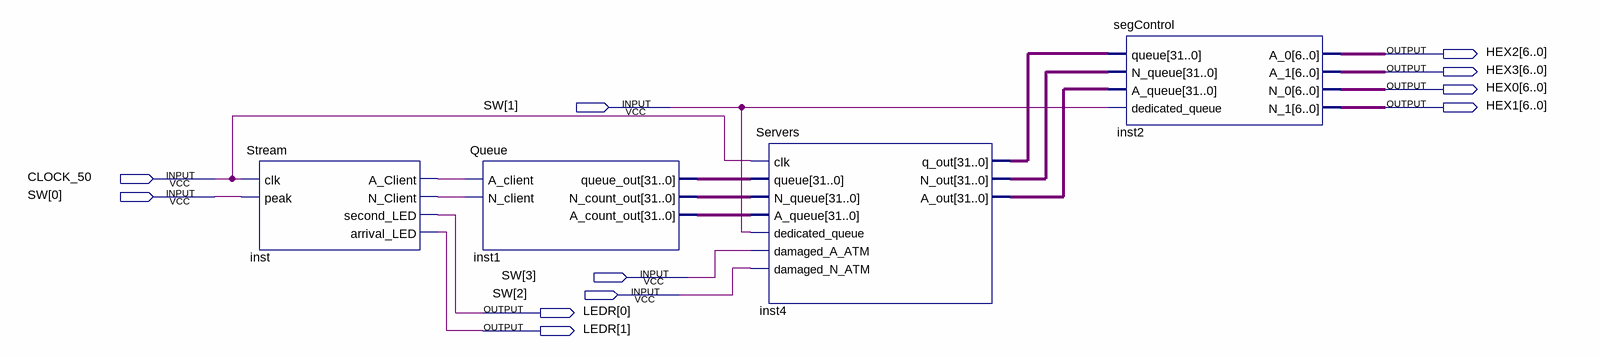
[diagram p0: schematic sheet]
// Quartus schematic ATM.bdf as structural Verilog: 4 symbols, 11 pins
module ATM (
  input  [3:0] SW,
  input  CLOCK_50,
  output [6:0] HEX2,
  output [6:0] HEX3,
  output [6:0] HEX0,
  output [6:0] HEX1,
  output [1:0] LEDR
);

  wire inst_a_client, inst_n_client;
  wire [31:0] inst1_a_count_out, inst1_n_count_out, inst1_queue_out, inst4_a_out, inst4_n_out, inst4_q_out;

  Stream inst (
    .clk(CLOCK_50), .peak(SW[0]), .A_Client(inst_a_client), .N_Client(inst_n_client), .second_LED(LEDR[0]),
    .arrival_LED(LEDR[1]));
  Queue inst1 (
    .A_client(inst_a_client), .N_client(inst_n_client), .queue_out(inst1_queue_out),
    .N_count_out(inst1_n_count_out), .A_count_out(inst1_a_count_out));
  Servers inst4 (
    .clk(CLOCK_50), .queue(inst1_queue_out), .N_queue(inst1_n_count_out), .A_queue(inst1_a_count_out),
    .dedicated_queue(SW[1]), .damaged_A_ATM(SW[3]), .damaged_N_ATM(SW[2]), .q_out(inst4_q_out),
    .N_out(inst4_n_out), .A_out(inst4_a_out));
  segControl inst2 (
    .queue(inst4_q_out), .N_queue(inst4_n_out), .A_queue(inst4_a_out), .dedicated_queue(SW[1]), .A_0(HEX2),
    .A_1(HEX3), .N_0(HEX0), .N_1(HEX1));
endmodule
